# EAGLE design matts pcb schematic v2 (EAGLE 9.6.1)
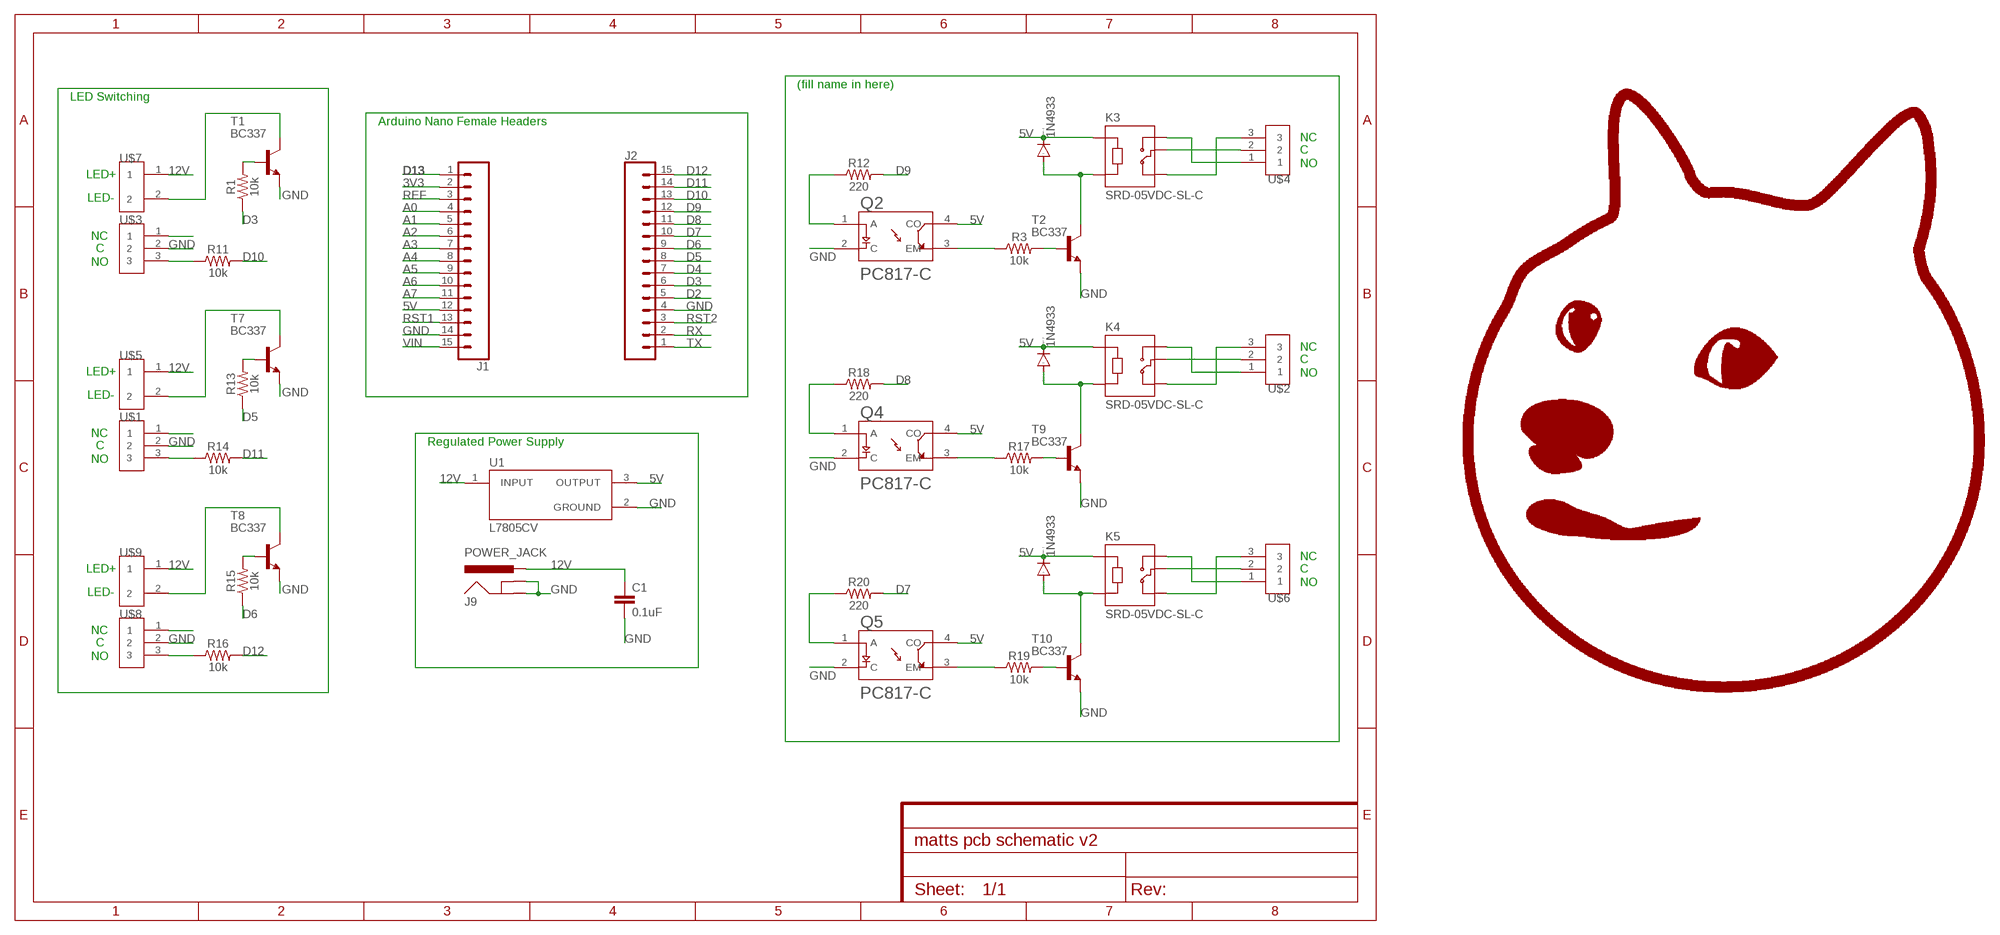
[diagram p0: schematic, sheet 1]

## Parts
C1  0.1uF  0.1UF-KIT-EZ-50V-20%  [CAP-PTH-SMALL-KIT]
D1  1N4933  [DO41-10]
D4  1N4933  [DO41-10]
D5  1N4933  [DO41-10]
J1  CONN_15  [1X15]
J2  CONN_15  [1X15]
J9  POWER_JACK  [POWER_JACK_PTH]
K3  SRD-05VDC-SL-C  [RELAY_SRD-05VDC-SL-C]
K4  SRD-05VDC-SL-C  [RELAY_SRD-05VDC-SL-C]
K5  SRD-05VDC-SL-C  [RELAY_SRD-05VDC-SL-C]
Q2  PC817-C  [DIP762W50P254L508H350Q4]
Q4  PC817-C  [DIP762W50P254L508H350Q4]
Q5  PC817-C  [DIP762W50P254L508H350Q4]
R1  10k  100KOHM-HORIZ-1/4W-1%  [AXIAL-0.3]
R3  10k  100KOHM-HORIZ-1/4W-1%  [AXIAL-0.3]
R11  10k  100KOHM-HORIZ-1/4W-1%  [AXIAL-0.3]
R12  220  100KOHM-HORIZ-1/4W-1%  [AXIAL-0.3]
R13  10k  100KOHM-HORIZ-1/4W-1%  [AXIAL-0.3]
R14  10k  100KOHM-HORIZ-1/4W-1%  [AXIAL-0.3]
R15  10k  100KOHM-HORIZ-1/4W-1%  [AXIAL-0.3]
R16  10k  100KOHM-HORIZ-1/4W-1%  [AXIAL-0.3]
R17  10k  100KOHM-HORIZ-1/4W-1%  [AXIAL-0.3]
R18  220  100KOHM-HORIZ-1/4W-1%  [AXIAL-0.3]
R19  10k  100KOHM-HORIZ-1/4W-1%  [AXIAL-0.3]
R20  220  100KOHM-HORIZ-1/4W-1%  [AXIAL-0.3]
T1  BC337  [TO92]
T2  BC337  [TO92]
T7  BC337  [TO92]
T8  BC337  [TO92]
T9  BC337  [TO92]
T10  BC337  [TO92]
U1  L7805CV  [TO255P1040X460X1968-3]
U$1  3PIN_0.2PITCH_SCREW_TERMINAL  [3PIN_0.2PITCH_SCREW_TERMINAL]
U$2  3PIN_0.2PITCH_SCREW_TERMINAL  [3PIN_0.2PITCH_SCREW_TERMINAL]
U$3  3PIN_0.2PITCH_SCREW_TERMINAL  [3PIN_0.2PITCH_SCREW_TERMINAL]
U$4  3PIN_0.2PITCH_SCREW_TERMINAL  [3PIN_0.2PITCH_SCREW_TERMINAL]
U$5  2PIN_0.2PITCH_SCREW_TERMINAL  [2PIN_0.2PITCH_SCREW_TERMINAL]
U$6  3PIN_0.2PITCH_SCREW_TERMINAL  [3PIN_0.2PITCH_SCREW_TERMINAL]
U$7  2PIN_0.2PITCH_SCREW_TERMINAL  [2PIN_0.2PITCH_SCREW_TERMINAL]
U$8  3PIN_0.2PITCH_SCREW_TERMINAL  [3PIN_0.2PITCH_SCREW_TERMINAL]
U$9  2PIN_0.2PITCH_SCREW_TERMINAL  [2PIN_0.2PITCH_SCREW_TERMINAL]
U$10  DANK_DOGE  [DANK_DOGE]

## Nets
3V3: J1.2
5V: D1.C D4.C D5.C J1.12 K3.A1 K4.A1 K5.A1 Q2.4(CO) Q4.4(CO) Q5.4(CO) U1.3(OUTPUT)
12V: C1.1 J9.PWR U1.1(INPUT) U$5.1 U$7.1 U$9.1
A0: J1.4
A1: J1.5
A2: J1.6
A3: J1.7
A4: J1.8
A5: J1.9
A6: J1.10
A7: J1.11
D2: J2.5
D3: J2.6 R1.P$1
D4: J2.7
D5: J2.8 R13.P$1
D6: J2.9 R15.P$1
D7: J2.10 R20.P$2
D8: J2.11 R18.P$2
D9: J2.12 R12.P$2
D10: J2.13 R11.P$2
D11: J2.14 R14.P$2
D12: J2.15 R16.P$2
D13: J1.1
GND: C1.2 J1.14 J2.4 J9.GND J9.GNDBREAK Q2.2(C) Q4.2(C) Q5.2(C) T1.1(E) T2.1(E) T7.1(E) T8.1(E) T9.1(E) T10.1(E) U1.2(GROUND) U$1.2 U$3.2 U$8.2
N$1: K3.COM U$4.2
N$2: U$1.1
N$3: R14.P$1 U$1.3
N$4: T1.3(C) U$7.2
N$5: T7.3(C) U$5.2
N$6: R1.P$2 T1.2(B)
N$7: R13.P$2 T7.2(B)
N$8: U$3.1
N$9: U$8.1
N$10: R11.P$1 U$3.3
N$12: R16.P$1 U$8.3
N$13: T8.3(C) U$9.2
N$14: R15.P$2 T8.2(B)
N$15: K3.NO U$4.1
N$16: K3.NC U$4.3
N$17: D1.A K3.A2 T2.3(C)
N$18: R3.P$2 T2.2(B)
N$19: Q2.3(EM) R3.P$1
N$20: Q2.1(A) R12.P$1
N$21: K4.COM U$2.2
N$22: K4.NO U$2.1
N$23: K4.NC U$2.3
N$24: D4.A K4.A2 T9.3(C)
N$25: Q4.1(A) R18.P$1
N$26: R17.P$2 T9.2(B)
N$27: Q4.3(EM) R17.P$1
N$28: K5.COM U$6.2
N$29: K5.NO U$6.1
N$30: K5.NC U$6.3
N$31: D5.A K5.A2 T10.3(C)
N$32: Q5.1(A) R20.P$1
N$33: R19.P$2 T10.2(B)
N$34: Q5.3(EM) R19.P$1
REF: J1.3
RST1: J1.13
RST2: J2.3
RX: J2.2
TX: J2.1
VIN: J1.15

## Notes on the sheet
- (fill name in here)
- LED Switching
- Arduino Nano Female Headers
- NC
- C
- NO
- LED+
- LED-
- NC
- C
- NO
- NC
- C
- LED+ | NO
- LED-
- NC
- Regulated Power Supply
- C
- NO
- NC
- LED+ | C
- NO
- LED-
- NC
- C
- NO

## Library data of the parts
C1 = SparkFun-Capacitors:0.1UF: 0.1µF ceramic capacitors A capacitor is a passive two-terminal electrical component used to store electrical energy temporarily in an electric field.; PROD_ID: CAP-08370
D1 D4 D5 = diode:1N4933: DIODE fast recovery rectifier, 1A
J1 J2 = SparkFun-Connectors:CONN_15: Multi connection point. Often used as Generic Header-pin footprint for 0.1 inch spaced/style header connections On any of the 0.1 inch spaced packages, you can populate with these: Break Away Headers - Straight <https://www.sparkfun.com/products/116> (PRT-00116) Break Away Male Headers - Right Angle <https://www.sparkfun.com/products/553> (PRT-00553) Female Headers <https://www.sparkfun.com/products/115> (PRT-00115) Break Away Headers - Machine Pin <https://www.sparkfun.com/products/117> (PRT-00117) Break Away Female Headers - Swiss Machine Pin <https://www.sparkfun.com/products/743> (PRT-00743) For SCREWTERMINALS and SPRING TERMINALS visit here: Screw Terimnals on SparkFun.com <https://www.sparkfun.com/search/results?term=Screw+Terminals> (5mm/3.5mm/2.54mm spacing) This device is also useful as a general connection point to wire up your design to another part of your project. Our various solder wires solder well into these plated through hole pads. Hook-Up Wire - Assortment (Stranded, 22 AWG) <https://www.sparkfun.com/products/11375> (PRT-11375) Hook-Up Wire - Assortment (Solid Core, 22 AWG) <https://www.sparkfun.com/products/11367> (PRT-11367) View the entire wire category on our website here <https://www.sparkfun.com/categories/141> Special notes: Molex polarized connector foot print use with SKU : PRT-08231 with associated crimp pins and housings. 1MM SMD Version SKU: PRT-10208 NOTES ON THE VARIANTS LOCK and LOCK_LONGPADS... This footprint was designed to help hold the alignment of a through-hole component (i.e. 6-pin header) while soldering it into place. You may notice that each hole has been shifted either up or down by 0.005 of an inch from it's more standard position (which is a perfectly straight line). This slight alteration caused the pins (the squares in the middle) to touch the edges of the holes. Because they are alternating, it causes a "brace" to hold the component in place. 0.005 has proven to be the perfect amount of "off-center" position when using our standard breakaway headers. Although looks a little odd when you look at the bare footprint, once you have a header in there, the alteration is very hard to notice. Also,if you push a header all the way into place, it is covered up entirely on the bottom side.
J9 = SparkFun-Connectors:POWER_JACK: Power Jack Connector This is the standard 5.5mm barrel jack for power. The PTH is the most common, proven, reliable, footprint. The Slot footprint only works if the mill layer is transmitted to the PCB fab house so be warned. Here are the connectors we sell at SparkFun: DC Barrel Power Jack/Connector <https://www.sparkfun.com/products/119> (PRT-00119) DC Barrel Power Jack/Connector (SMD) <https://www.sparkfun.com/products/12748> (PRT-12748) DC Barrel Jack Adapter - Breadboard Compatible <https://www.sparkfun.com/products/10811> (PRT-10811) It is used on this SparkFun product (and many, many others): SparkFun RedBoard - Programmed with Arduino <https://www.sparkfun.com/products/12757> (DEV-12757) Also, if you need a mating power supply or connector, please check these out: Wall Adapter Power Supply - 9VDC 650mA <https://www.sparkfun.com/products/298> (TOL-00298) DC Barrel Jack Adapter - Male <https://www.sparkfun.com/products/10287> (PRT-10287); PROD_ID: CONN-08197
K3-K5 = SRD-05VDC-SL-C:SRD-05VDC-SL-C: 5V Trigger Relay Module For Arduino And Raspberry Pi 5V Trigger Relay Module For Arduino And Raspberry Pi; AVAILABILITY: Unavailable; DESCRIPTION: 5V Trigger Relay Module For Arduino And Raspberry Pi 5V Trigger Relay Module For Arduino And Raspberry Pi; MF: Songle Relay; MP: SRD-05VDC-SL-C; PACKAGE: None; PRICE: None
Q2 Q4 Q5 = PC817-C:PC817-C: Optocoupler; THT; Channels: 1; Out: transistor; Uinsul: 5kV; Uce: 35V; AVAILABILITY: Unavailable; DESCRIPTION: Optoisolator Transistor Output 5000Vrms 1 Channel 4-DIP; MF: Taiwan Semiconductor; MP: PC817-C; PACKAGE: DIP-4 Taiwan Semiconductor; PRICE: None
R1 R3 R11-R20 = SparkFun-Resistors:100KOHM: 100kΩ resistor A resistor is a passive two-terminal electrical component that implements electrical resistance as a circuit element. Resistors act to reduce current flow, and, at the same time, act to lower voltage levels within circuits. - Wikipedia; PROD_ID: RES-12184; VALUE: 100k
T1 T2 T7-T10 = transistor:BC337: NPN TRANSISTOR
U1 = L7805CV:L7805CV: Standard Regulator Pos 5V 1.5A 3-Pin(3+Tab) TO-220 Standard Regulator Pos 5V 1.5A 3-Pin(3+Tab) TO-220; AVAILABILITY: Unavailable; DESCRIPTION: Linear Voltage Regulator IC 1 Output 1.5A TO-220; MF: STMicroelectronics; MP: L7805CV; PACKAGE: TO-220 STMicroelectronics; PRICE: None
U$1-U$4 U$6 U$8 = SparkFun-Connectors:3PIN_0.2PITCH_SCREW_TERMINAL
U$5 U$7 U$9 = SparkFun-Connectors:2PIN_0.2PITCH_SCREW_TERMINAL
U$10 = SparkFun-Aesthetics:DANK_DOGE

## Board
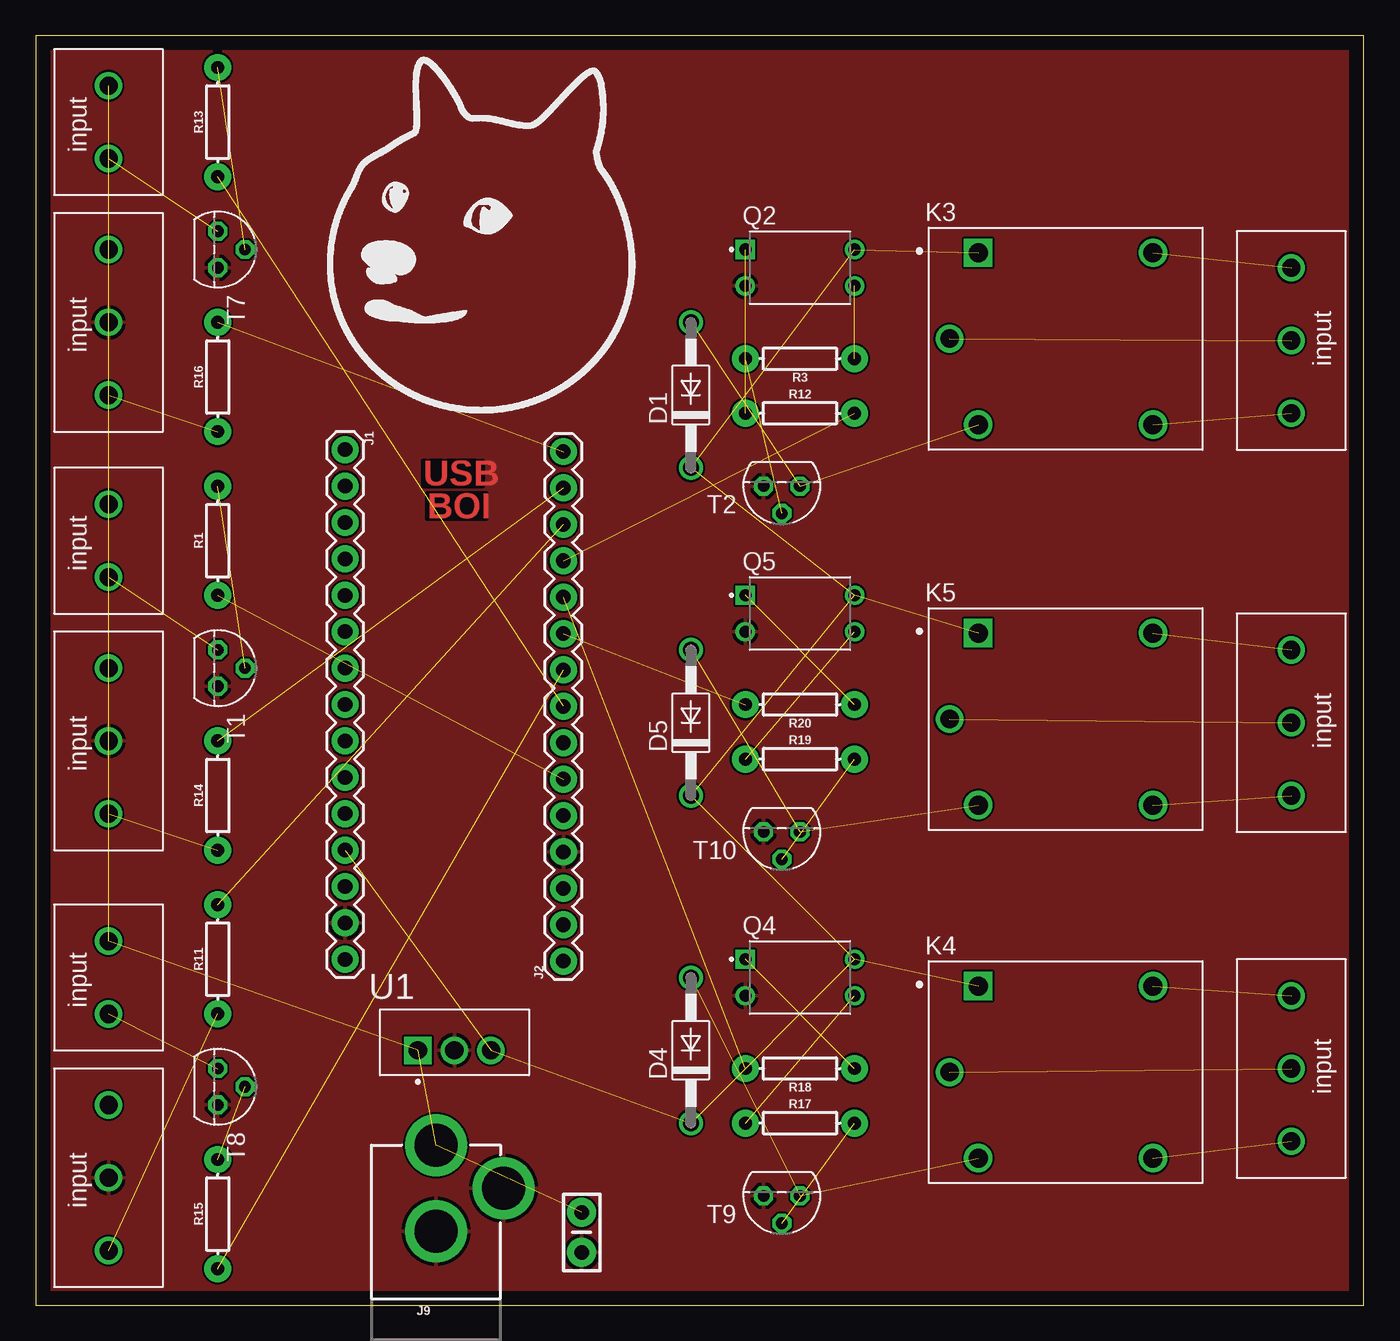
[diagram p1: board, top side]

Size 92.69 x 88.57 mm. Coordinates in mm from the lower left corner, seen from the top.
Outline: 0,0 92.69,0 92.69,88.57 0,88.57 0,0
Copper layers (1*16): Top 0.035mm / dielectric 1.5mm / Bottom 0.035mm
Design rules "default": minimum track width 6mil, minimum drill 0.35mm, track to track 6mil, track to pad 6mil, pad to pad 6mil, via to via 6mil, smd to smd 6mil, copper to edge 40mil, drill to drill 6mil, minimum pad ring 10mil, minimum via ring 8mil, stop-mask expansion 4mil, vias tented up to drill 0mil, thermal gap 10mil

### Footprints (pad centres in the part's own frame; a part is rotated, then mirrored left to right if it is on the bottom)
CAP-PTH-SMALL-KIT = drill 1.016 pad 2.032: 1 -1.397,0; 2 1.397,0
DO41-10 = drill 1.118: A 5.08,0; C -5.08,0
1X15 = drill 1.016 pad 1.88: 1 0,0; 2 2.54,0; 3 5.08,0; 4 7.62,0; 5 10.16,0; 6 12.7,0; 7 15.24,0; 8 17.78,0; 9 20.32,0; 10 22.86,0; 11 25.4,0; 12 27.94,0; 13 30.48,0; 14 33.02,0; 15 35.56,0
POWER_JACK_PTH = drill 2.997 pad 4.318: GND 0,7.7; GNDBREAK 4.7,10.7; PWR 0,13.7
RELAY_SRD-05VDC-SL-C = drill 1.32 square: A1 -6.1,6 | drill 1.32: A2 -6.1,-6; NC 6.1,6; NO 6.1,-6 | drill 1.29: COM -8.1,0
DIP762W50P254L508H350Q4 = drill 0.84 pad 1.26 square: 1 -3.81,1.27 | drill 0.84 pad 1.26: 2 -3.81,-1.27; 3 3.81,-1.27; 4 3.81,1.27
AXIAL-0.3 = drill 0.9 pad 1.88: P$1 -3.81,0; P$2 3.81,0
TO92 = drill 0.813 octagon: 1 1.27,0; 2 0,1.905; 3 -1.27,0
TO255P1040X460X1968-3 = drill 1.27 pad 1.91 square: 1 0,0 | drill 1.27 pad 1.91: 2 2.55,0; 3 5.1,0
3PIN_0.2PITCH_SCREW_TERMINAL = drill 1.27: 1 -5.08,0; 2 0,0; 3 5.08,0
2PIN_0.2PITCH_SCREW_TERMINAL = drill 1.27: 1 -2.54,0; 2 2.54,0

### Placement (x,y rotation side)
C1  38.1,5.08 270 top
D1  45.72,63.5 90 top
D4  45.72,17.78 90 top
D5  45.72,40.64 90 top
J1  21.59,59.69 270 top
J2  36.83,24 90 top
J9  27.94,-2.54 0 top
K3  71.88,67.44 0 top
K4  71.88,16.26 0 top
K5  71.88,40.89 0 top
Q2  53.34,72.39 0 top
Q4  53.34,22.86 0 top
Q5  53.34,48.26 0 top
R1  12.7,53.34 90 top
R3  53.34,66.04 180 top
R11  12.7,24.13 90 top
R12  53.34,62.23 0 top
R13  12.7,82.55 90 top
R14  12.7,35.56 90 top
R15  12.7,6.35 90 top
R16  12.7,64.77 90 top
R17  53.34,12.7 0 top
R18  53.34,16.51 180 top
R19  53.34,38.1 0 top
R20  53.34,41.91 180 top
T1  12.7,44.45 270 top
T2  52.07,57.15 180 top
T7  12.7,73.66 270 top
T8  12.7,15.24 270 top
T9  52.07,7.62 180 top
T10  52.07,33.02 180 top
U1  26.67,17.78 0 top
U$1  5.08,39.37 270 top
U$2  87.63,16.51 90 top
U$3  5.08,8.89 270 top
U$4  87.63,67.31 90 top
U$5  5.08,82.55 270 top
U$6  87.63,40.64 90 top
U$7  5.08,53.34 270 top
U$8  5.08,68.58 270 top
U$9  5.08,22.86 270 top
U$10  30.48,72.39 0 top

### Tracks (layer width: path | path; a pad name or v marks a point on that pad's centre or on a via)
5V  (10 unrouted)
12V  (5 unrouted)
D3  (1 unrouted)
D5  (1 unrouted)
D6  (1 unrouted)
D7  (1 unrouted)
D8  (1 unrouted)
D9  (1 unrouted)
D10  (1 unrouted)
D11  (1 unrouted)
D12  (1 unrouted)
GND
  pour Top: -2.54,91.44 -2.54,-2.54 95.25,-2.54 95.25,91.44
N$1  (1 unrouted)
N$3  (1 unrouted)
N$4  (1 unrouted)
N$5  (1 unrouted)
N$6  (1 unrouted)
N$7  (1 unrouted)
N$10  (1 unrouted)
N$12  (1 unrouted)
N$13  (1 unrouted)
N$14  (1 unrouted)
N$15  (1 unrouted)
N$16  (1 unrouted)
N$17  (2 unrouted)
N$18  (1 unrouted)
N$19  (1 unrouted)
N$20  (1 unrouted)
N$21  (1 unrouted)
N$22  (1 unrouted)
N$23  (1 unrouted)
N$24  (2 unrouted)
N$25  (1 unrouted)
N$26  (1 unrouted)
N$27  (1 unrouted)
N$28  (1 unrouted)
N$29  (1 unrouted)
N$30  (1 unrouted)
N$31  (2 unrouted)
N$32  (1 unrouted)
N$33  (1 unrouted)
N$34  (1 unrouted)

### Text on the board
Top: USB | BOI